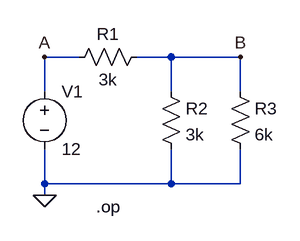
[diagram p0: schematic OP Point.asc]
OP Point.asc, the LTspice schematic file:
Version 4
SHEET 1 1096 680
WIRE 64 64 16 64
WIRE 192 64 144 64
WIRE 288 64 192 64
WIRE 16 112 16 64
WIRE 192 112 192 64
WIRE 288 112 288 64
WIRE 16 240 16 192
WIRE 192 240 192 192
WIRE 192 240 16 240
WIRE 288 240 288 192
WIRE 288 240 192 240
WIRE 16 256 16 240
FLAG 16 256 0
FLAG 16 64 A
FLAG 288 64 B
SYMBOL voltage 16 96 R0
SYMATTR InstName V1
SYMATTR Value 12
SYMBOL res 160 48 R90
WINDOW 0 0 56 VBottom 2
WINDOW 3 32 56 VTop 2
SYMATTR InstName R1
SYMATTR Value 3k
SYMBOL res 176 96 R0
SYMATTR InstName R2
SYMATTR Value 3k
SYMBOL res 272 96 R0
SYMATTR InstName R3
SYMATTR Value 6k
TEXT 88 272 Left 2 !.op

The netlist it stands for:
* OP Point.asc
V1 A 0 12
R1 B A 3k
R2 B 0 3k
R3 B 0 6k
.op
.backanno
.end